# Altium schematic sheet Quad-RS232-1.0-USB.SchDoc: Quad UART - FTDI
size A4; Revision: 1.0; SheetNumber: 2; SheetTotal: 4
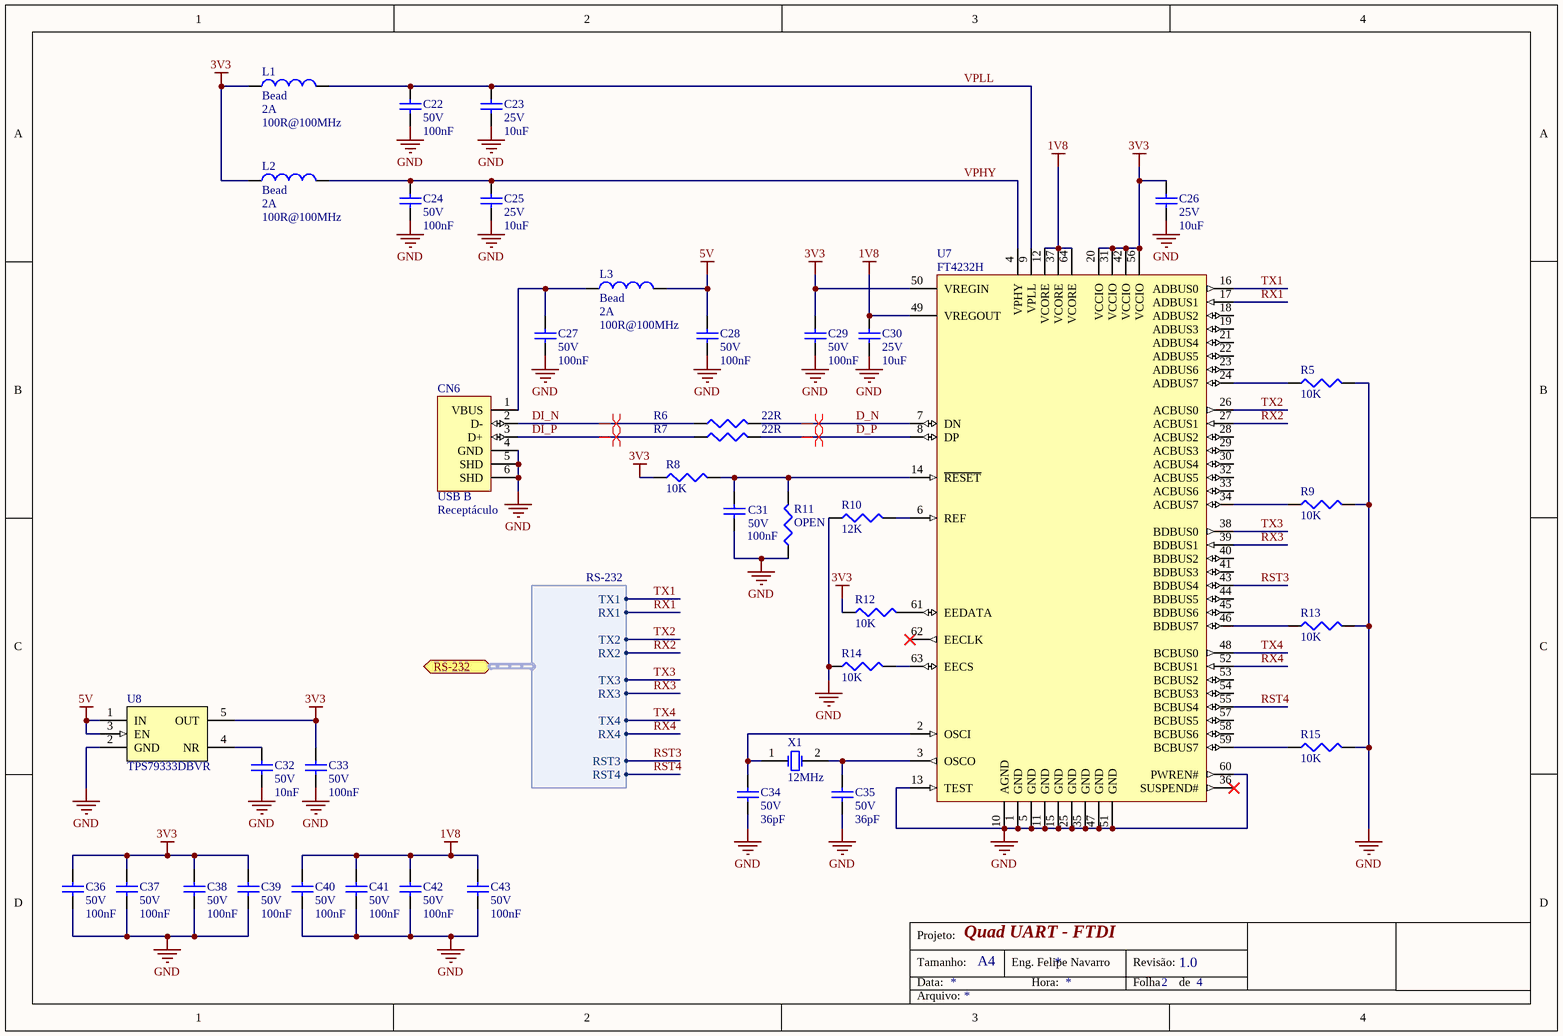
[diagram p0: Quad-RS232-1.0-USB.SchDoc]

## Parts
C22  value 100nF  Tensão: 50V  [CC0603]  (hidden comment: Capacitor Cerâmico)
C23  value 10uF  Tensão: 25V  [CC0805]  (hidden comment: Capacitor Cerâmico)
C24  value 100nF  Tensão: 50V  [CC0603]  (hidden comment: Capacitor Cerâmico)
C25  value 10uF  Tensão: 25V  [CC0805]  (hidden comment: Capacitor Cerâmico)
C26  value 10uF  Tensão: 25V  [CC0805]  (hidden comment: Capacitor Cerâmico)
C27  value 100nF  Tensão: 50V  [CC0603]  (hidden comment: Capacitor Cerâmico)
C28  value 100nF  Tensão: 50V  [CC0603]  (hidden comment: Capacitor Cerâmico)
C29  value 100nF  Tensão: 50V  [CC0603]  (hidden comment: Capacitor Cerâmico)
C30  value 10uF  Tensão: 25V  [CC0805]  (hidden comment: Capacitor Cerâmico)
C31  value 100nF  Tensão: 50V  [CC0603]  (hidden comment: Capacitor Cerâmico)
C32  value 10nF  Tensão: 50V  [CC0603]  (hidden comment: Capacitor Cerâmico)
C33  value 100nF  Tensão: 50V  [CC0603]  (hidden comment: Capacitor Cerâmico)
C34  value 36pF  Tensão: 50V  [CC0603]  (hidden comment: Capacitor Cerâmico)
C35  value 36pF  Tensão: 50V  [CC0603]  (hidden comment: Capacitor Cerâmico)
C36  value 100nF  Tensão: 50V  [CC0603]  (hidden comment: Capacitor Cerâmico)
C37  value 100nF  Tensão: 50V  [CC0603]  (hidden comment: Capacitor Cerâmico)
C38  value 100nF  Tensão: 50V  [CC0603]  (hidden comment: Capacitor Cerâmico)
C39  value 100nF  Tensão: 50V  [CC0603]  (hidden comment: Capacitor Cerâmico)
C40  value 100nF  Tensão: 50V  [CC0603]  (hidden comment: Capacitor Cerâmico)
C41  value 100nF  Tensão: 50V  [CC0603]  (hidden comment: Capacitor Cerâmico)
C42  value 100nF  Tensão: 50V  [CC0603]  (hidden comment: Capacitor Cerâmico)
C43  value 100nF  Tensão: 50V  [CC0603]  (hidden comment: Capacitor Cerâmico)
CN6  USB B  value Receptáculo  [CONN_USB-B_RCPT-H]
L1  Bead  value 100R@100MHz  Corrente: 2A  [CC0603]
L2  Bead  value 100R@100MHz  Corrente: 2A  [CC0603]
L3  Bead  value 100R@100MHz  Corrente: 2A  [CC0603]
R5  value 10K  [CC0603]  (hidden comment: Resistor)
R6  value 22R  [CC0603]  (hidden comment: Resistor)
R7  value 22R  [CC0603]  (hidden comment: Resistor)
R8  value 10K  [CC0603]  (hidden comment: Resistor)
R9  value 10K  [CC0603]  (hidden comment: Resistor)
R10  value 12K  [CC0603]  (hidden comment: Resistor)
R11  value OPEN  [CC0603]  (hidden comment: Resistor)
R12  value 10K  [CC0603]  (hidden comment: Resistor)
R13  value 10K  [CC0603]  (hidden comment: Resistor)
R14  value 10K  [CC0603]  (hidden comment: Resistor)
R15  value 10K  [CC0603]  (hidden comment: Resistor)
U7  FT4232H  [TQFP-64N]
U8  TPS79333DBVR  [SOT-23-5N]
X1  12MHz  [HC/49US]

## Ports
RS-232 (harness RS-232)

## Harnesses
RS-232: TX1, RX1, TX2, RX2, TX3, RX3, TX4, RX4, RST3, RST4

## Nets
1V8: C30.2 C40.2 C41.2 C42.2 C43.2 U7.12(VCORE) U7.37(VCORE) U7.49(VREGOUT) U7.64(VCORE)
3V3: C26.2 C29.2 C33.2 C36.2 C37.2 C38.2 C39.2 L1.1 L2.1 R8.1 R12.1 U7.20(VCCIO) U7.31(VCCIO) U7.42(VCCIO) U7.50(VREGIN) U7.56(VCCIO) U8.5(OUT)
5V: C28.2 L3.2 U8.1(IN) U8.3(EN)
GND: C22.1 C23.1 C24.1 C25.1 C26.1 C27.1 C28.1 C29.1 C30.1 C31.1 C32.1 C33.1 C34.1 C35.1 C36.1 C37.1 C38.1 C39.1 C40.1 C41.1 C42.1 C43.1 CN6.4(GND) CN6.5(SHD) CN6.6(SHD) R5.2 R9.2 R10.1 R11.1 R13.2 R14.1 R15.2 U7.1(GND) U7.5(GND) U7.10(AGND) U7.11(GND) U7.13(TEST) U7.15(GND) U7.25(GND) U7.35(GND) U7.47(GND) U7.51(GND) U7.60(PWREN#) U8.2(GND)
D_N: R6.2 U7.7(DN)
D_P: R7.2 U7.8(DP)
DI_N: CN6.2(D-) R6.1
DI_P: CN6.3(D+) R7.1
RST3: U7.43(BDBUS4) ; port RS-232.RST3
RST4: U7.55(BCBUS4) ; port RS-232.RST4
RX1: U7.17(ADBUS1) ; port RS-232.RX1
RX2: U7.27(ACBUS1) ; port RS-232.RX2
RX3: U7.39(BDBUS1) ; port RS-232.RX3
RX4: U7.52(BCBUS1) ; port RS-232.RX4
TX1: U7.16(ADBUS0) ; port RS-232.TX1
TX2: U7.26(ACBUS0) ; port RS-232.TX2
TX3: U7.38(BDBUS0) ; port RS-232.TX3
TX4: U7.48(BCBUS0) ; port RS-232.TX4
VPHY: C24.2 C25.2 L2.2 U7.4(VPHY)
VPLL: C22.2 C23.2 L1.2 U7.9(VPLL)
NetC27_2: C27.2 CN6.1(VBUS) L3.1
NetC31_2: C31.2 R8.2 R11.2 U7.14(~{RESET})
NetC32_2: C32.2 U8.4(NR)
NetC34_2: C34.2 U7.2(OSCI) X1.1(OSC1)
NetC35_2: C35.2 U7.3(OSCO) X1.2(OSC2)
NetR5_1: R5.1 U7.24(ADBUS7)
NetR9_1: R9.1 U7.34(ACBUS7)
NetR10_2: R10.2 U7.6(REF)
NetR12_2: R12.2 U7.61(EEDATA)
NetR13_1: R13.1 U7.46(BDBUS7)
NetR14_2: R14.2 U7.63(EECS)
NetR15_1: R15.1 U7.59(BCBUS7)

Not connected (* = marked no-connect by the designer): U7 18(ADBUS2) 19(ADBUS3) 21(ADBUS4) 22(ADBUS5) 23(ADBUS6) 28(ACBUS2) 29(ACBUS3) 30(ACBUS4) 32(ACBUS5) 33(ACBUS6) 36(SUSPEND#)* 40(BDBUS2) 41(BDBUS3) 44(BDBUS5) 45(BDBUS6) 53(BCBUS2) 54(BCBUS3) 57(BCBUS5) 58(BCBUS6) 62(EECLK)*

## Layout directives
differential pair: D_N, D_P, DI_N, DI_P

## Notes on the sheet
- Projeto:
- Tamanho:
- Data:
- A4
- Eng. Felipe Navarro
- Hora:
- Revisão:
- Folha
- de
- Arquivo:

## Library data of the parts
C22 C24 C27-C29 C31 C33 C36-C43 = Cap 100nF 50V 0603 X7R: Capacitor (Semiconductor SIM Model); Chinês: Local; ChinesePrice: 0,00250; Corrente: *A; Potência: *W; Obs:: X7R; Tolerância: ±10%; Supplier 1: Digi-Key; Supplier Part Number 1: 1276-1000-1-ND; ComponentLink1Description: Datasheet; ComponentLink1URL: D:\Tecnoclade\Datasheet\!DataMissing.pdf
C23 C25 C26 C30 = Cap 10uF 25V 0805 X5R: Capacitor (Semiconductor SIM Model); Chinês: Local; ChinesePrice: 0,02620; Corrente: *A; Potência: *W; Obs:: X5R; Tolerância: ±10%; Supplier 1: Digi-Key; Supplier Part Number 1: 587-2985-1-ND; ComponentLink1Description: Datasheet; ComponentLink1URL: D:\Tecnoclade\Datasheet\!DataMissing.pdf
C32 = Cap 10nF 50V 0603 X7R 5%: Capacitor (Semiconductor SIM Model); Chinês: Local; ChinesePrice: 0,00320; Corrente: *A; Potência: *W; Obs:: X7R; Tolerância: ±5%; Supplier 1: Digi-Key; Supplier Part Number 1: 399-1092-1-ND; ComponentLink1Description: Datasheet; ComponentLink1URL: D:\Tecnoclade\Datasheet\!DataMissing.pdf
C34 C35 = Cap 36pF 50V 0603 NP0: Capacitor (Semiconductor SIM Model); Chinês: -----; ChinesePrice: 0,00000; Corrente: *A; Potência: *W; Obs:: NP0; Tolerância: ±5%; Supplier 1: Digi-Key; Supplier Part Number 1: 490-1416-1-ND; ComponentLink1Description: Datasheet; ComponentLink1URL: D:\Tecnoclade\Datasheet\!DataMissing.pdf
CN6 = USB B RCPT-H: Conector Jack USB B, Through Hole, Right Angle, Horizontal; ChinesePrice: 0,00000; Chinês: ----; Obs:: USB 2.0; Corrente: *; Potência: *; Supplier 1: Digi-Key; Supplier Part Number 1: A31725-ND; Tensão: *; Tolerância: *; ComponentLink1Description: Datasheet; ComponentLink1URL: D:\Tecnoclade\Datasheet\!DataMissing.pdf
L1-L3 = Bd 100R@100MHz 0603 2A: ChinesePrice: 0,00000; Chinês: ----; Obs:: Ferrite (0R04); Tolerância: ±25%; Potência: *; Supplier 1: Digi-Key; Supplier Part Number 1: 445-2984-1-ND; Tensão: *; ComponentLink1Description: Datasheet; ComponentLink1URL: D:\Tecnoclade\Datasheet\!DataMissing.pdf; Substituição: 00/00/0000
R5 R8 R9 R11-R15 = Res 10K 1% 0603 1/10W: ChinesePrice: 0,00089; Chinês: Local; Corrente: *A; Potência: 1/10W; Tensão: *V; Tolerância: ±1%; Supplier 1: Digi-Key; Obs: *; ComponentLink1Description: Datasheet; ComponentLink1URL: D:\Tecnoclade\Datasheet\!DataMissing.pdf
  R5 R8 R9 R12-R15: Supplier Part Number 1: P10.0KHCT-ND
R6 R7 = Res 22R 1% 0603 1/10W: ChinesePrice: 0,00000; Chinês: ----; Corrente: *A; Potência: 1/10W; Tensão: *V; Obs: ±100ppm/ºC; Tolerância: ±1%; Supplier 1: Digi-Key; Supplier Part Number 1: RMCF0603FT22R0CT-ND; ComponentLink1Description: Datasheet; ComponentLink1URL: D:\Tecnoclade\Datasheet\!DataMissing.pdf
R10 = Res 12K 1% 0603 1/10W: ChinesePrice: 0,00089; Chinês: Local; Corrente: *A; Potência: 1/10W; Tensão: *V; Tolerância: ±1%; Supplier 1: Digi-Key; Supplier Part Number 1: 311-12.0KHRCT-ND; Obs: *; ComponentLink1Description: Datasheet; ComponentLink1URL: D:\Tecnoclade\Datasheet\!DataMissing.pdf
U7 = FT2232H: FT2232H DUAL HIGH SPEED USB TO MULTIPURPOSE UART/FIFO IC; ChinesePrice: 0,00000; Chinês: ----; Supplier Part Number 1: 768-1026-1-ND; Supplier 1: Digi-Key; Corrente: *; Potência: *; Tensão: *; Value: *; Obs:: *; Tolerância: *; ComponentLink1Description: Datasheet; ComponentLink1URL: D:\Tecnoclade\Datasheet\
U8 = TPS79333: ULTRALOW-NOISE, HIGH PSRR, FAST RF 200mA LOW-DROPOUT LINEAR  REGULATORS I; Tensão: 3V3; ChinesePrice: 0,00000; Chinês: ----; Corrente: 200mA; Potência: *; Supplier 1: Digi-Key; Supplier Part Number 1: 296-12961-1-ND; Value: *; Obs:: *; Tolerância: *; ComponentLink1Description: Datasheet; ComponentLink1URL: D:\Tecnoclade\Datasheet\
X1 = XTAL: Crystal Oscillator; ChinesePrice: 0,00000; Chinês: ----; Value: 20pF/40R; Corrente: *; Potência: *; Supplier 1: Digi-Key; Supplier Part Number 1: --Del; Tensão: *; Obs:: *; Tolerância: *